# EAGLE design WeMos-RFM69 (EAGLE 7.6.0)
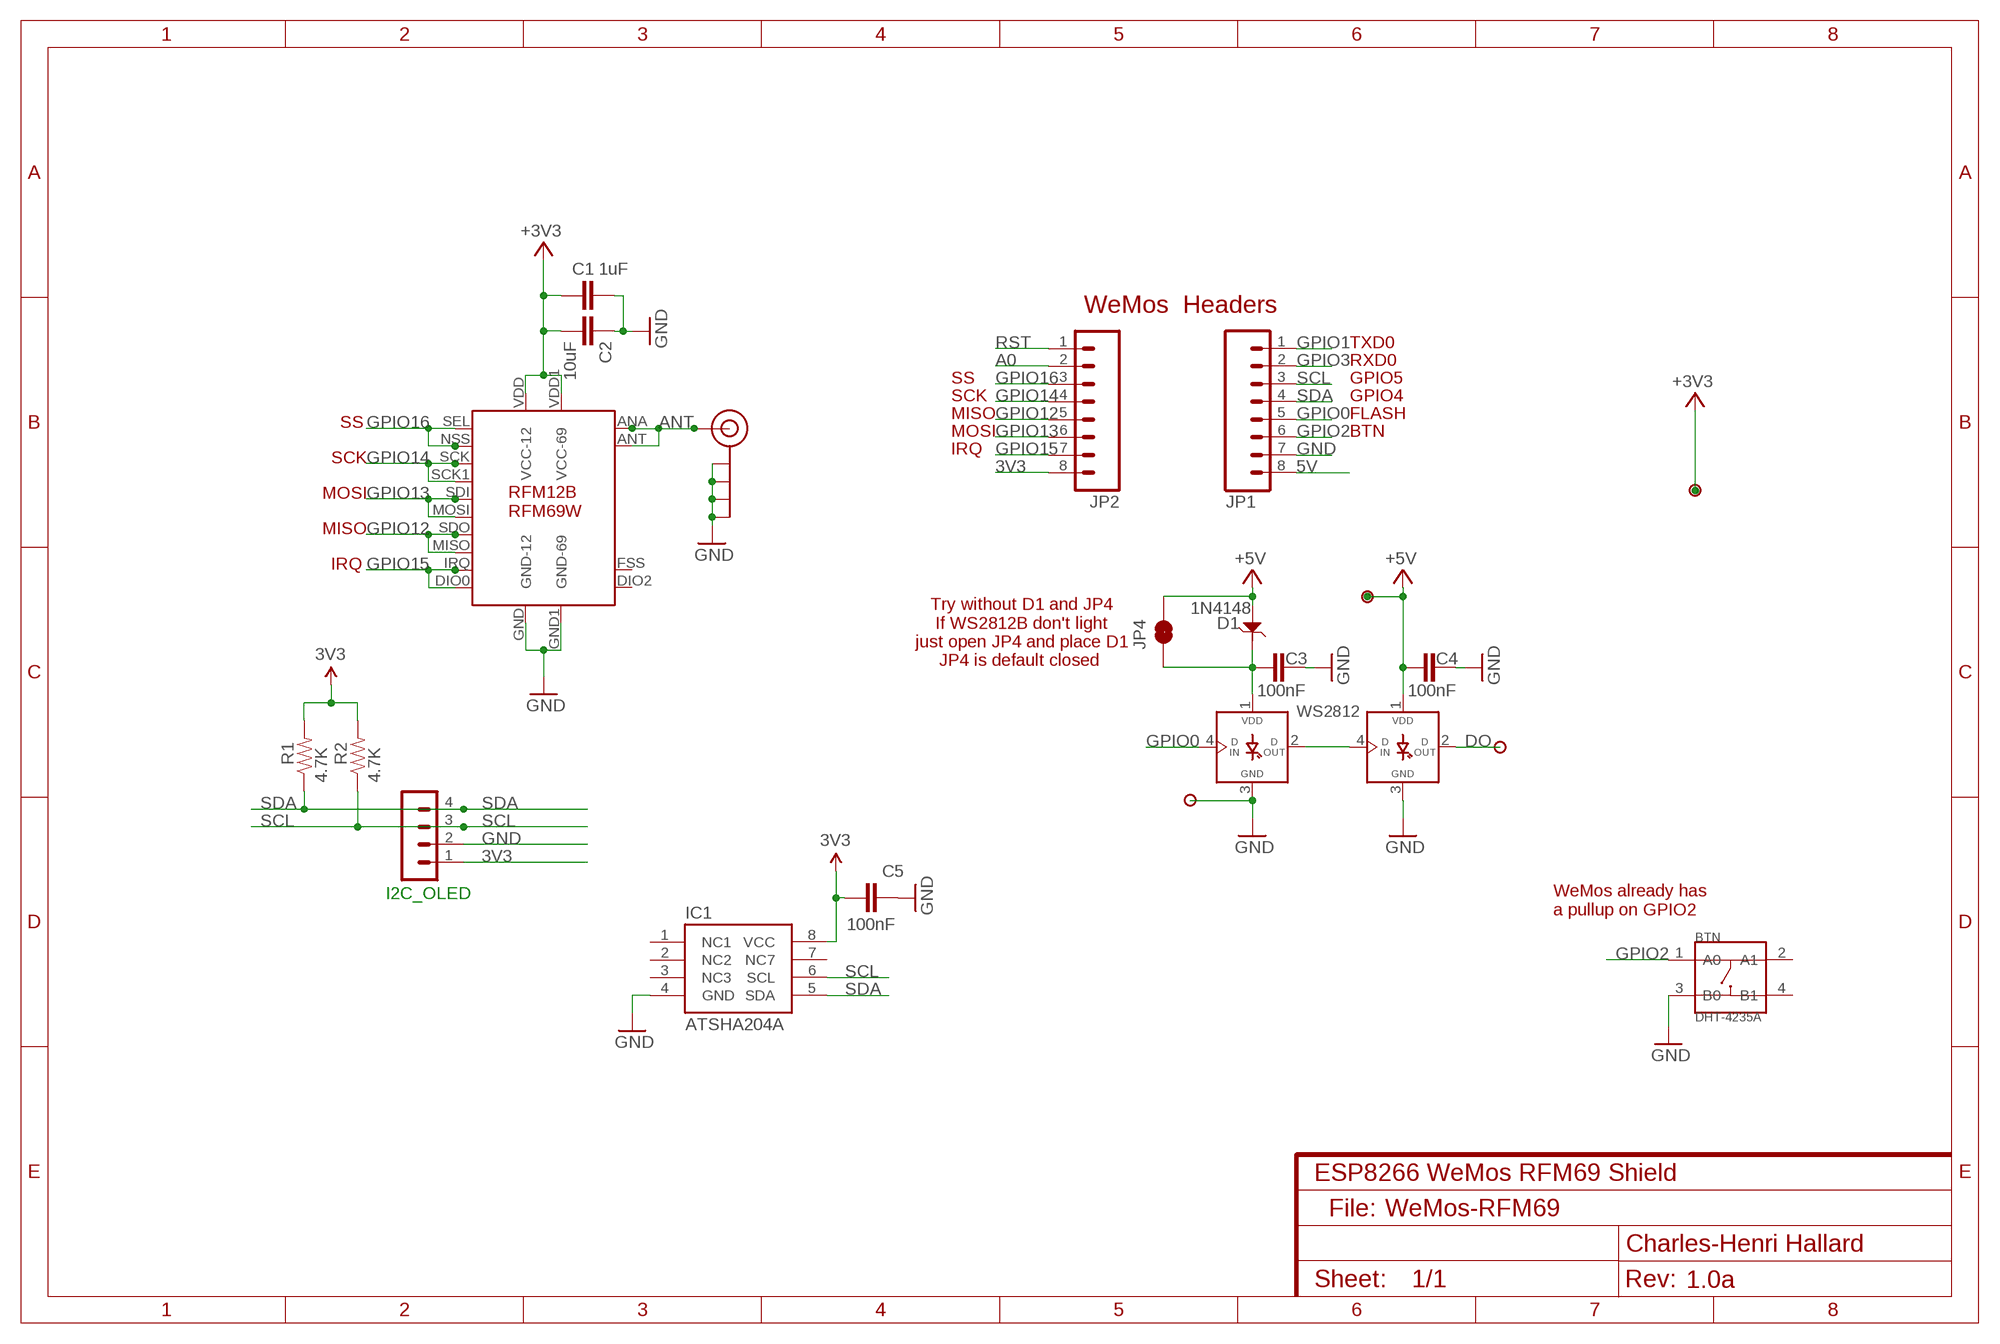
[diagram p0: schematic, sheet 1]
NAME (FRAME-A4L): CNAME: ESP8266 WeMos RFM69 Shield; CREVISION: 1.0a; DESIGNER: Charles-Henri Hallard

## Parts
BTN  DHT-4235A  SMD-BUTTON-TOP-DHT-4235A(4P-4.2X3.2MM)  [SW4-SMD-4.2X3.2X2.5MM]
C1  1uF  CAP0805-CAP-LARGEPADS  [0805-CAP-LARGEPADS]
C2  10uF  CAP0805-CAP-LARGEPADS  [0805-CAP-LARGEPADS]
C3  100nF  CAP0805-CAP  [0805-CAP]
C4  100nF  CAP0805-CAP  [0805-CAP]
C5  100nF  CAP0805-CAP  [0805-CAP]
D1  1N4148  D-ESD-2P-CESD5V0D1  [SOD123-2.7X1.6]
I2C_OLED  CON_HEADER_1X04'LOCK'  [1X04_LOCK]
IC1  ATSHA204A  ATSHA204_SOIC8  [SOIC8]
J$1  ANTENNATINY  [SMA_UFL_PAD_TINY]
JP1  M08NO_SILK_FEMALE_PTH  [1X08_NO_SILK]
JP2  M08NO_SILK_FEMALE_PTH  [1X08_NO_SILK]
JP4  JUMPER-PAD-2-NC_BY_TRACE  [PAD-JUMPER-2-NC_BY_TRACE_YES_SILK]
P1  PADNORMAL  [PAD]
P2  PADNORMAL  [PAD]
P3  PADNORMAL  [PAD]
P4  PADNORMAL  [PAD]
R1  4.7K  RESISTOR0805-RES  [0805-RES]
R2  4.7K  RESISTOR0805-RES  [0805-RES]
U$1  RFM-DUAL  [RFM-DUAL]
WS1  WS2812B  WS2812BSMD  [WS2812B]
WS2812  WS2812B  WS2812BSMD  [WS2812B]

## Nets
3V3: C1.2 C2.2 C5.2 I2C_OLED.1 IC1.8(VCC) JP2.8 P4.1 R1.2 R2.2 U$1.VDD1(VCC-69) U$1.VDD(VCC-12) ; supply symbol labelled +3V3
5V: C4.1 D1.1 JP1.8 JP4.2 P1.1 WS1.1(VDD) ; supply symbol labelled +5V
A0: JP2.2
ANT: J$1.ANT1(SIGNAL) J$1.ANT2(SIGNAL) J$1.ANT3(SIGNAL) U$1.ANA(ANT-12) U$1.ANT(ANT-69)
DO: P2.1 WS1.2(DOUT)
GND: BTN.3(B0) C1.1 C2.1 C3.2 C4.2 C5.1 I2C_OLED.2 IC1.4(GND) J$1.GND1(GND) J$1.GND2(GND) J$1.GND3(GND) J$1.GND4(GND) JP1.7 P3.1 U$1.GND1(GND-69) U$1.GND(GND-12) WS1.3(GND) WS2812.3(GND)
GPIO0: JP1.5 WS2812.4(DIN)
GPIO1: JP1.1
GPIO2: BTN.1(A0) JP1.6
GPIO3: JP1.2
GPIO12: JP2.5 U$1.MISO U$1.SDO
GPIO13: JP2.6 U$1.MOSI U$1.SDI
GPIO14: JP2.4 U$1.SCK U$1.SCK1
GPIO15: JP2.7 U$1.DIO0 U$1.IRQ
GPIO16: JP2.3 U$1.NSS(SEL-12) U$1.SEL(SEL-69)
N$1: WS1.4(DIN) WS2812.2(DOUT)
RST: JP2.1
SCL: I2C_OLED.3 IC1.6(SCL) JP1.3 R2.1
SDA: I2C_OLED.4 IC1.5(SDA) JP1.4 R1.1
VLED: C3.1 D1.2 JP4.1 WS2812.1(VDD)
Unconnected: BTN.2(A1) BTN.4(B1) IC1.1(NC1) IC1.2(NC2) IC1.3(NC3) IC1.7(NC7) U$1.DIO2 U$1.FSS(FFS)

## Notes on the sheet
- WeMos  Headers
- TXD0
- RXD0
- SS | GPIO5
- SCK | GPIO4
- MISO | FLASH
- SS
- MOSI | BTN
- IRQ
- SCK
- MOSI
- MISO
- IRQ
- Try without D1 and JP4
  If WS2812B don't light
  just open JP4 and place D1
  JP4 is default closed
- WeMos already has
  a pullup on GPIO2
- File:

## Library data of the parts
BTN = Switch-2016:SMD-BUTTON-TOP-DHT-4235A(4P-4.2X3.2MM): 311020045; MPN: DHT-4235A
C1-C5 = _c2h:CAP: Capacitor Standard 0603 ceramic capacitor, and 0.1" leaded capacitor.
D1 = Seeed-Discrete:D-ESD-2P: Diodes for Protectiong against ESD
I2C_OLED = _c2h:CON_HEADER_1X04
IC1 = SparkFun-DigitalIC:ATSHA204_SOIC8: ATSHA204; PROD_ID: IC-11981
J$1 = _c2h:ANTENNA: SMA Antenna Connector End launch SMA connector. The paste layer has been removed so that the connector can be hand soldered onto the board after reflow.
JP1 JP2 = SparkFun-Connectors:M08: Header 8 Standard 8-pin 0.1" header. Use with straight break away headers (SKU : PRT-00116), right angle break away headers (PRT-00553), swiss pins (PRT-00743), machine pins (PRT-00117), and female headers (PRT-00115).; PROD_ID: CONN-08438
JP4 = SparkFun-Passives:JUMPER-PAD-2-NC_BY_TRACE
P1-P4 = _c2h:PAD
R1 R2 = _c2h:RESISTOR: Resistor Basic schematic elements and footprints for 0603, 1206, and PTH resistors.
U$1 = _c2h:RFM-DUAL
WS1 WS2812 = _c2h:WS2812B

## Net classes
0 default: width 0.203 mm, drill 0.356 mm, clearance 0.152 mm
1 power: width 0.203 mm, clearance 0.152 mm

## Board
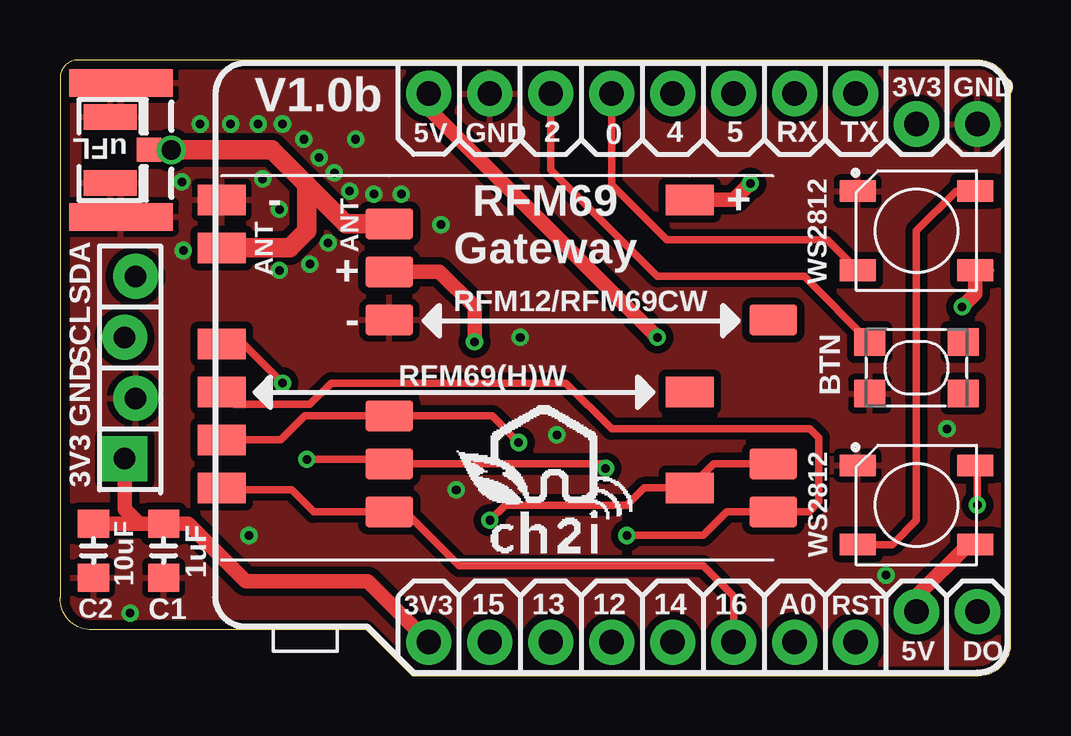
[diagram p1: board, top side]
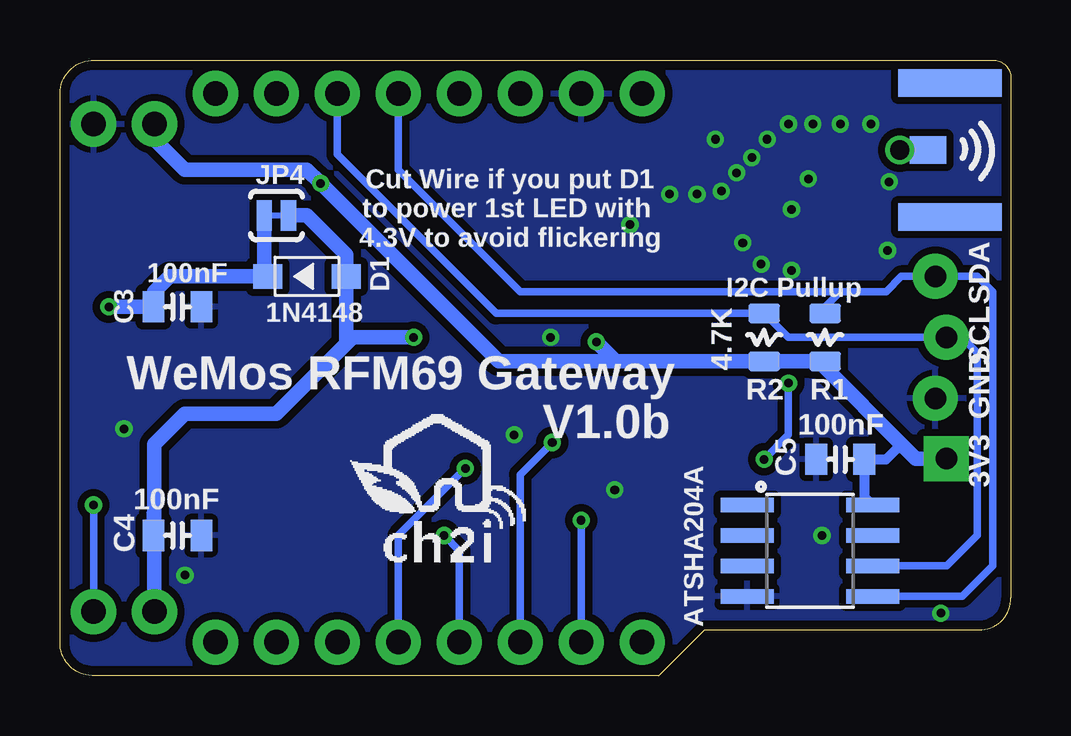
[diagram p2: board, bottom side, seen from below]

Size 39.62 x 25.65 mm. Coordinates in mm from the lower left corner, seen from the top.
Outline: 38.2,25.65 0.76,25.65 arc90 0,24.89 0,3.24 arc90 1.33,1.91 12.76,1.91 14.67,0 38.29,0 arc90 39.62,1.4 39.62,24.26 arc90 38.2,25.65
Copper layers (1*16): Top 0.0356mm / dielectric 1.5011mm / Bottom 0.0356mm
Design rules "PCBs_io *": minimum track width 6mil, minimum drill 13mil, track to track 6mil, track to pad 6mil, pad to pad 6mil, via to via 6mil, smd to smd 6mil, copper to edge 15mil, drill to drill 6mil, minimum pad ring 7mil, minimum via ring 7mil, stop-mask expansion 3mil, vias tented up to drill 40mil, thermal gap 10mil

### Footprints (pad centres in the part's own frame; a part is rotated, then mirrored left to right if it is on the bottom)
SW4-SMD-4.2X3.2X2.5MM = smd 1.3 x 1.15: 1 -1.95,1.075; 2 1.95,1.075; 3 -1.95,-1.075; 4 1.95,-1.075
0805-CAP-LARGEPADS = smd 1.156 x 1.3: 1 -1.127,0; 2 1.127,0
0805-CAP = smd 0.902 x 1.3: 1 -1,0; 2 1,0
SOD123-2.7X1.6 = smd 1.2 x 1.02: 1 -1.635,0; 2 1.635,0
1X04_LOCK = drill 0.9 pad 1.88 square: 1 1.295,1.372 | drill 0.9 pad 1.88: 2 3.81,0.914; 3 6.35,1.372; 4 8.89,0.914
SOIC8 = smd 0.61 x 2.21: 1 -1.905,-2.616; 2 -0.635,-2.616; 3 0.635,-2.616; 4 1.905,-2.616; 5 1.905,2.616; 6 0.635,2.616; 7 -0.635,2.616; 8 -1.905,2.616
SMA_UFL_PAD_TINY = smd 1.016 x 1: ANT1 -3.525,0 | drill 0.8: ANT2 -4.445,0 | smd 1.524 x 1.143 bottom: ANT3 -3.271,0 | smd 2.2 x 1.05: GND1 -1.905,1.375; GND2 -1.905,-1.375 | smd 4.318 x 1.143: GND3 -2.349,-2.794; GND4 -2.349,2.794 | smd 4.318 x 1.143 bottom: GND5 -2.349,2.794; GND6 -2.349,-2.794
1X08_NO_SILK = drill 1.016 pad 1.88: 1 0,0; 2 2.54,0; 3 5.08,0; 4 7.62,0; 5 10.16,0; 6 12.7,0; 7 15.24,0; 8 17.78,0
PAD-JUMPER-2-NC_BY_TRACE_YES_SILK = smd 0.635 x 1.27: 1 -0.508,0; 2 0.508,0
PAD = drill 1.016 pad 1.88: 1 0,0
0805-RES = smd 0.8 x 1.3: 1 -1,0; 2 1,0
RFM-DUAL = smd 2 x 1.27: ANA -10.54,5; ANT -3.555,6; DIO0 8.96,-5; DIO2 8.96,-1.012; FSS 12.447,2; GND -3.555,2; GND1 -10.54,7; IRQ 12.445,-4; MISO -10.54,-1; MOSI -10.54,-3; NSS -10.54,-5; SCK -3.555,-4; SCK1 -10.54,1; SDI -3.555,-2; SDO 12.445,-6; SEL -3.555,-6; VDD -3.555,4; VDD1 8.96,7
WS2812B = smd 1.5 x 0.9: 1 2.45,-1.65; 2 2.45,1.65; 3 -2.45,1.65; 4 -2.45,-1.65

### Placement (x,y rotation side)
BTN  35.69,12.83 0 top
C1  4.32,5.21 90 top
C2  1.4,5.21 90 top
C3  34.73,15.37 0 bottom
C4  34.73,5.84 0 bottom
C5  7.11,9.02 0 bottom
D1  29.34,16.64 180 bottom
I2C_OLED  4.06,7.75 90 top
IC1  8.38,5.21 270 bottom
J$1  0.19,21.91 180 top
JP1  33.15,24.26 180 top
JP2  33.15,1.4 180 top
JP4  30.61,19.18 0 bottom
P1  35.69,2.67 0 top
P2  38.23,2.67 0 top
P3  38.23,22.99 0 top
P4  35.69,22.99 0 top
R1  7.75,14.1 270 bottom
R2  10.29,14.1 270 bottom
U$1  17.27,12.83 0 top
U$2  [LOGO_CH2I_75MM]  20.64,7.11 0 top
U$4  [LOGO_CH2I_75MM]  23.43,6.73 0 bottom
WS1  35.69,7.11 0 top
WS2812  35.69,18.54 0 top

### Tracks (layer width: path | path; a pad name or v marks a point on that pad's centre or on a via)
3V3  (via drill 0.36 pad 0.71)
  Top 0.61: JP2.8 12.83,3.94 7.75,3.94 5.35,6.33 C1.2 3.3,6.33 | C2.2 3.3,6.33 | U$1.VDD 15.81,16.83 17.27,15.37 v17.27,13.91 | U$1.VDD1 28.08,19.83 v28.77,20.51 | I2C_OLED.1 2.69,6.94 3.3,6.33
  Bottom 0.406: 4.57,9.65 5.21,9.02 C5.2 6.1,9 6.1,7.44 IC1.8
  Bottom 0.61: 16.46,13.1 v17.27,13.91 | 16.46,13.1 R2.2 R1.2 7.75,12.83 4.57,9.65 3.96,9.04 I2C_OLED.1 | 16.46,13.1 21.35,13.1 v28.77,20.51 29.34,21.08 34.42,21.08 35.69,22.35 P4.1
5V  (via drill 0.36 pad 0.71)
  Top 0.61: v24.89,14.1 15.37,23.62 JP1.8 | WS1.1 37.85,5.46 35.69,3.3 P1.1
  Bottom 0.61: 27.7,13.83 D1.1 27.7,17.54 29.34,19.18 JP4.2 | 27.7,13.83 30.61,10.92 34.42,10.92 35.69,9.65 35.69,7.16 C4.1 35.69,7.06 P1.1 | v24.89,14.1 27.43,14.1 27.7,13.83
ANT
  Top 0.305: J$1.ANT2 J$1.ANT1
  Top 0.813: J$1.ANT2 8.83,21.91 10.29,20.45 | U$1.ANA 9.57,17.83 10.29,18.54 10.29,20.45 | U$1.ANT 11.91,18.83 10.29,20.45
  Bottom 0.61: J$1.ANT3 J$1.ANT2
DO  (via drill 0.36 pad 0.71)
  Top 0.305: v38.23,7.11 38.23,8.67 WS1.2
  Bottom 0.305: P2.1 v38.23,7.11
GND  (via drill 0.36 pad 0.71)
  other vias: 34.42,4.19 36.96,10.29 2.92,2.6 16.51,7.75 20.7,10.03 10.41,17.14 7.87,5.84 19.18,14.1 12.32,22.35 5.84,22.99 7.11,22.99 8.25,22.99 9.27,22.99 10.16,22.35 10.79,21.59 11.43,20.95 12.06,20.19 9.14,19.43 8.45,20.7 11.18,18.03 13.08,20.07 14.22,20.07 15.87,18.8 5.08,20.57 5.14,17.72 9.14,16.89
  pour Bottom (isolate 0.305): 40.77,26.8 40.77,-1.14 -1.14,-1.14 -1.14,26.8
  pour Top (isolate 0.305): -0.51,26.16 40.13,26.16 40.13,-0.51 -0.51,-0.51
GPIO0
  Top 0.305: JP1.5 22.99,20.45 25.27,18.16 31.97,18.16 WS2812.4
GPIO2
  Top 0.305: JP1.6 20.45,21.08 24.89,16.64 31,16.64 BTN.1
GPIO12  (via drill 0.36)
  Top 0.305: U$1.MISO 7.26,11.3 10.41,11.3 11.3,12.19 21.08,12.19 22.99,10.29 31.24,10.29 31.62,9.91 31.62,7.24 31.21,6.83 U$1.SDO 27.78,6.83 26.8,5.84 v23.62,5.84
  Bottom 0.305: v23.62,5.84 22.99,5.21 JP2.5
GPIO13  (via drill 0.36)
  Top 0.305: v19.11,9.71 18,10.83 U$1.SDI 10.19,10.83 9.19,9.83 U$1.MOSI
  Bottom 0.305: v19.11,9.71 20.45,8.38 JP2.6
GPIO14  (via drill 0.36)
  Top 0.305: v22.73,8.64 22.54,8.83 U$1.SCK 13.53,9.02 v10.29,9.02 | U$1.SCK1 7.64,13.83 v9.27,12.19
  Bottom 0.305: v22.73,8.64 25.53,5.84 JP2.4 | v9.27,12.19 9.27,10.03 v10.29,9.02
GPIO15  (via drill 0.36)
  Top 0.305: U$1.IRQ 27.23,8.83 U$1.DIO0 24.34,7.83 23.62,7.11 18.54,7.11 v17.91,6.48
  Bottom 0.305: v17.91,6.48 JP2.7
GPIO16
  Top 0.305: U$1.NSS 6.81,7.75 9.65,7.75 10.57,6.83 U$1.SEL 14.38,6.83 16.64,4.57 26.8,4.57 28.07,3.3 JP2.3
N$1
  Top 0.305: WS1.4 34.67,5.46 35.69,6.48 35.69,18.54 37.34,20.19 WS2812.2
SCL
  Bottom 0.305: JP1.3 28.07,21.72 21.45,15.1 R2.1 9.29,14.1 I2C_OLED.3 2.03,14.1 1.4,13.46 1.4,5.84 2.67,4.57 IC1.6
SDA
  Bottom 0.305: JP1.4 25.53,21.08 20.45,16 7.11,16 | IC1.5 2.03,3.3 0.76,4.57 0.76,16 1.4,16.64 I2C_OLED.4 4.57,16.64 5.21,16 7.11,16 | R1.1 7.75,15.37 7.11,16
VLED  (via drill 0.36 pad 0.71)
  Top 0.61: 38.61,16.89 WS2812.1 38.14,15.91 v37.59,15.37
  Bottom 0.61: v37.59,15.37 C3.1 35.69,15.41 35.69,16 35.05,16.64 D1.2 31.12,16.78 JP4.1

### Text on the board
tNames: V1.0b | 3V3 | GND | 5V | GND | 2 | 0 | 4 | 5 | RX | TX | RFM69 / Gateway | SDA | SCL | GND | 3V3 | WS2812 | 3V3 | 15 | 13 | 12 | 14 | 16 | A0 | RST | 5V | DO
bNames: JP4 | Cut Wire if you put D1 / to power 1st LED with / 4.3V to avoid flickering | I2C Pullup | SDA | SCL | WeMos RFM69 Gateway | GND | V1.0b | 3V3